# EAGLE schematic protoboard5vpsrev1 (EAGLE 5.06)
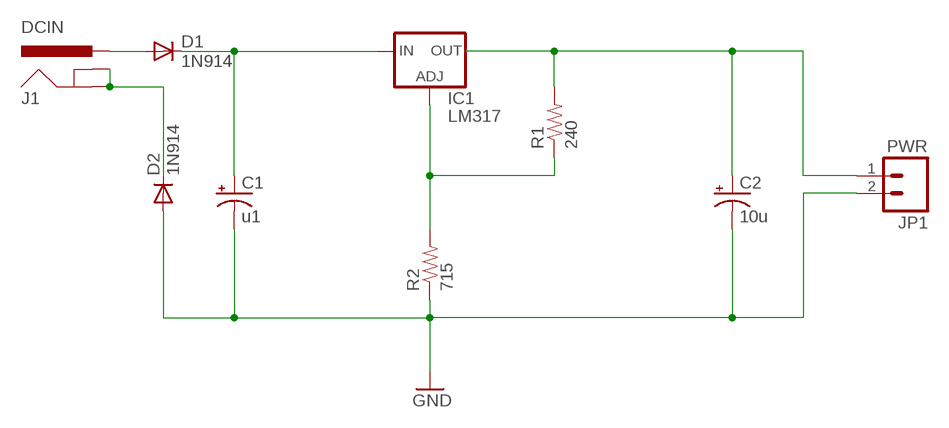
[diagram p0: schematic, sheet 1]

## Parts
C1  u1  CAP_POLPTH2  [CPOL-RADIAL-10UF-25V]
C2  10u  CAP_POLPTH2  [CPOL-RADIAL-10UF-25V]
D1  1N914  DIODE1N4148  [DIODE-1N4148]
D2  1N914  DIODE1N4148  [DIODE-1N4148]
IC1  LM317  LM317TL  [317TL]
J1  DCIN  POWER_JACKPTH  [POWER_JACK_PTH]
JP1  PWR  M02LOCK  [1X02_LOCK]
R1  240  RESISTORPTH1  [AXIAL-0.3]
R2  715  RESISTORPTH1  [AXIAL-0.3]

## Nets
GND: C1.2(-) C2.2(-) D2.A JP1.2 R2.P$1
N$1: C1.1(+) D1.C IC1.3(IN)
N$2: IC1.1(ADJ) R1.P$1 R2.P$2
N$3: D1.A J1.PWR
N$4: D2.C J1.GND J1.GNDBREAK
N$5: C2.1(+) JP1.1 R1.P$2
Unconnected: IC1.2(OUT)

## Library data of the parts
C1 C2 = SparkFun-2009-11-03:CAP_POL: Capacitor Polarized These are standard SMD and PTH capacitors. Normally 10uF, 47uF, and 100uF in electrolytic and tantalum varieties. Always verify the external diameter of the through hole cap, it varies with capacity, voltage, and manufacturer. The EIA devices should be standard.
D1 D2 = SparkFun-2009-11-03:DIODE: Diode These are standard reverse protection diodes and small signal diodes. SMA package can handle up to about 1A. SOD-323 can handle about 200mA. What the SOD-323 package when ordering, there are some mfgs out there that are 5-pin packages.
IC1 = v-reg:LM317TL: VOLTAGE REGULATOR
J1 = SparkFun-2009-11-03:POWER_JACK: Power Jack This is the standard 5.5mm barrel jack for power. The PTH is the most common, proven, reliable, footprint. All others are experimental. The Slot footprint only works if the mill layer is transmitted to the PCB fab house so be warned. Spark Fun Electronics SKU : PRT-00119. Mating wall wart : TOL-00298 (and others)
JP1 = SparkFun-2009-11-03:M02: Header 2 Standard 2-pin 0.1" header. Use with straight break away headers (SKU : PRT-00116), right angle break away headers (PRT-00553), swiss pins (PRT-00743), machine pins (PRT-00117), and female headers (PRT-00115). Molex polarized connector foot print use with SKU : PRT-08233 with associated crimp pins and housings.
R1 R2 = SparkFun-2009-11-03:RESISTOR: Resistor Basic schematic elements and footprints for 0603, 1206, and PTH 1/10th watt (small) resistors.